# EAGLE design JoystickBreakout (EAGLE 5.07)
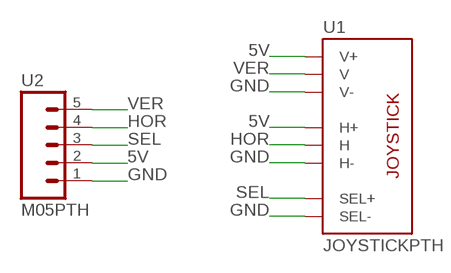
[diagram p0: schematic, sheet 1]

## Parts
U1  JOYSTICKPTH  [JOYSTICK]
U2  M05PTH  [1X05]

## Nets
5V: U1.H1(H+) U1.V1(V+) U2.2
GND: U1.B2A(SEL-) U1.H3(H-) U1.V3(V-) U2.1
HOR: U1.H2(H) U2.4
SEL: U1.B1A(SEL+) U2.3
VER: U1.V2(V) U2.5

## Library data of the parts
U1 = SparkFun:JOYSTICK: Thumb Joystick Joystick commonly found in PS2 controllers. Two pots and a select switch. Footprint proven. Spark Fun Electronics SKU : COM-09032
U2 = Robot:M05: 5-PIN HEADER Standard 5-pin 0.1" header.

## Board
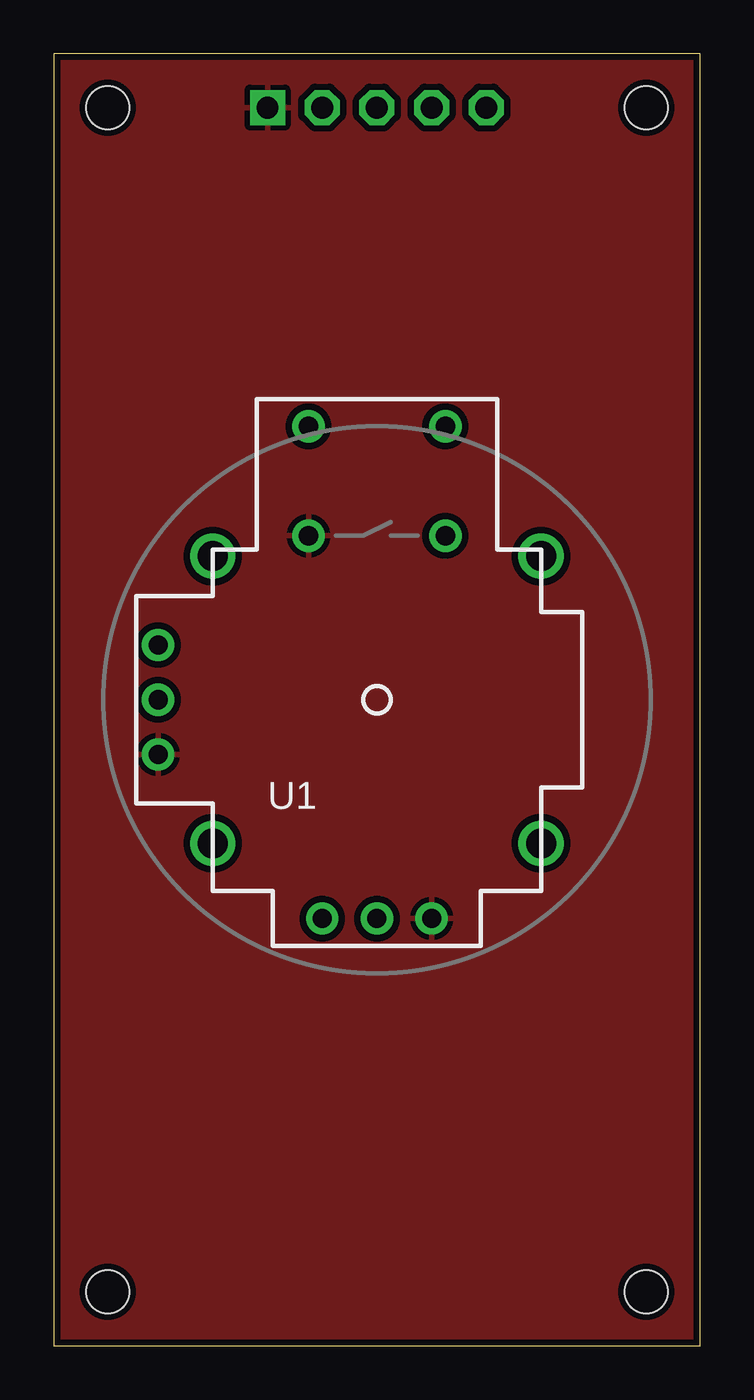
[diagram p1: board, top side]
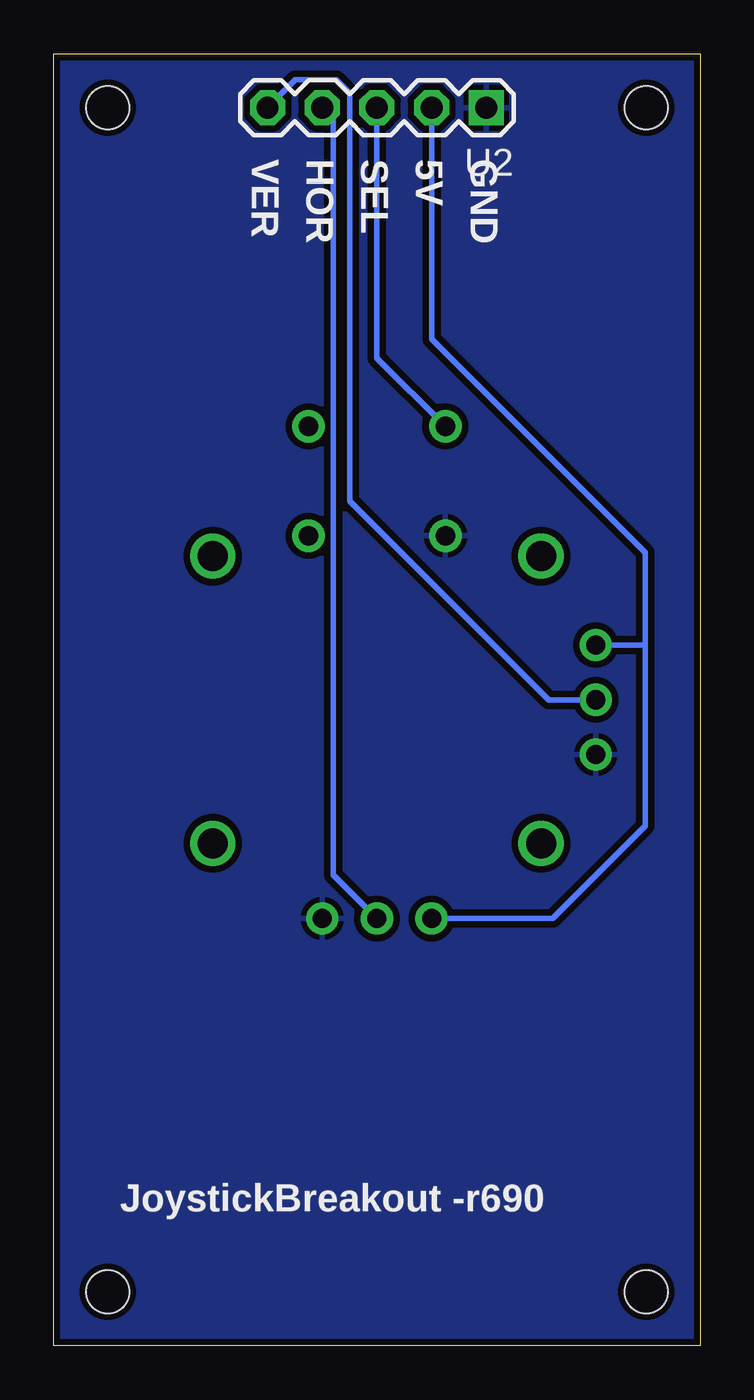
[diagram p2: board, bottom side, seen from below]

Size 30 x 60 mm. Coordinates in mm from the lower left corner, seen from the top.
Outline: 0,0 30,0 30,60 0,60 0,0
Copper layers (1*16): Top 0.035mm / dielectric 1.5mm / Bottom 0.035mm
Design rules "SparkFun": minimum track width 8mil, minimum drill 20mil, track to track 8mil, track to pad 8mil, pad to pad 8mil, via to via 8mil, smd to smd 8mil, copper to edge 10mil, drill to drill 8mil, minimum pad ring 12mil, minimum via ring 10mil, stop-mask expansion 4mil, vias tented up to drill 25mil, thermal gap 10mil
Holes 2 mm at 2.5,2.5 2.5,57.5 27.5,57.5 27.5,2.5

### Footprints (pad centres in the part's own frame; a part is rotated, then mirrored left to right if it is on the bottom)
JOYSTICK = drill 0.9 round: B1A -3.175,12.7; B1B 3.175,12.7; B2A -3.175,7.62; B2B 3.175,7.62 | drill 0.889 round: H1 -2.54,-10.16; H2 0,-10.16; H3 2.54,-10.16; V1 -10.16,2.54; V2 -10.16,0; V3 -10.16,-2.54 | drill 1.397 round: MOUNT1 -7.62,6.668; MOUNT2 -7.62,-6.668; MOUNT3 7.62,-6.668; MOUNT4 7.62,6.668
1X05 = drill 1.016 square: 1 0,0 | drill 1.016 octagon: 2 2.54,0; 3 5.08,0; 4 7.62,0; 5 10.16,0

### Placement (x,y rotation side)
U1  15,30 0 top
U2  9.92,57.5 180 bottom

### Tracks (layer width: path | path; a pad name or v marks a point on that pad's centre or on a via)
5V
  Bottom 0.254: U2.2 12.46,46.75 2.54,36.83 2.54,32.54 | U1.H1 6.83,19.84 2.54,24.13 2.54,32.54 | 2.54,32.54 U1.V1
GND
  pour Bottom (isolate 0.305): 0,0 0,60 30,60 30,0
  pour Top (isolate 0.305): 0,0 0,60 30,60 30,0
HOR
  Bottom 0.254: U1.H2 17.02,21.86 17.02,56.98 U2.4
SEL
  Bottom 0.254: U2.3 15,45.88 U1.B1A
VER
  Bottom 0.254: U2.5 20.08,57.52 18.8,58.8 16.89,58.8 16.26,58.17 16.26,39.23 7.03,30 U1.V2

### Text on the board
bPlace: GND | 5V | SEL | HOR | VER | JoystickBreakout -r690